# Altium schematic sheet Arduino_Nano_snippit.SchDoc
size B; Organization: CWRUbotix; Address1: 10900 Euclid Avenue; Address2: Cleveland, OH 44106; Address3: USA
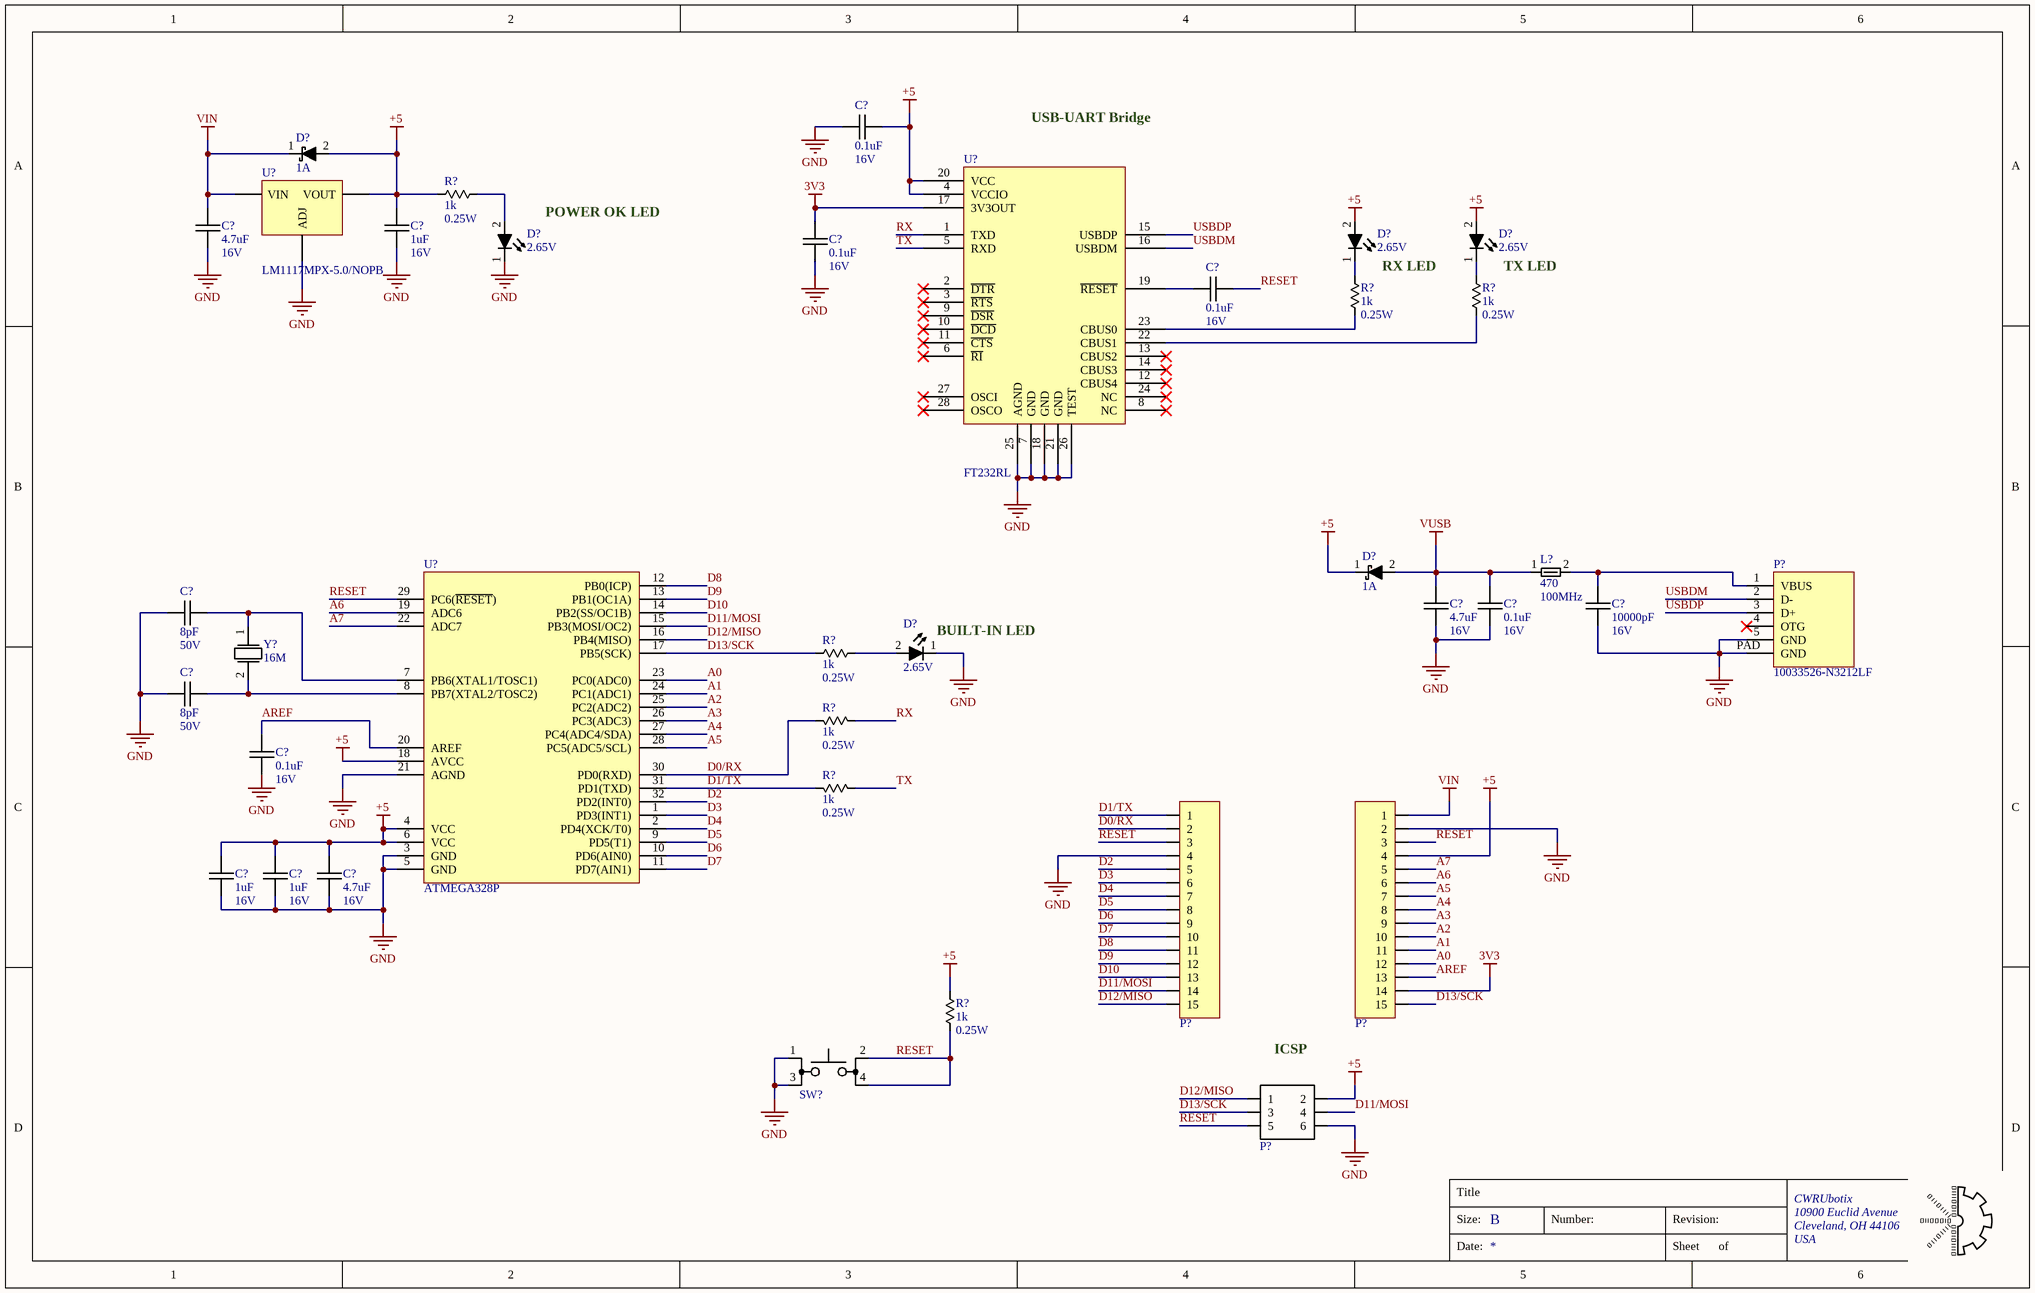
[diagram p0: Arduino_Nano_snippit.SchDoc]

## Parts
(Parts that share a designator on the sheet are numbered #1, #2 ... from top to bottom, then left to right.)
C?#1  Capacitance: 0.1uF  Voltage Rating: 16V  [chip_0603]  (hidden comment: cap_single_np)
C?#2  Capacitance: 4.7uF  Voltage Rating: 16V  [chip_0805]  (hidden comment: cap_single_np)
C?#3  Capacitance: 1uF  Voltage Rating: 16V  [chip_0805]  (hidden comment: cap_single_np)
C?#4  Capacitance: 0.1uF  Voltage Rating: 16V  [chip_0603]  (hidden comment: cap_single_np)
C?#5  Capacitance: 0.1uF  Voltage Rating: 16V  [chip_0603]  (hidden comment: cap_single_np)
C?#6  Capacitance: 0.1uF  Voltage Rating: 16V  [chip_0603]  (hidden comment: cap_single_np)
C?#7  Capacitance: 8pF  Voltage Rating: 50V  [chip_0603]  (hidden comment: cap_single_np)
C?#8  Capacitance: 4.7uF  Voltage Rating: 16V  [chip_0805]  (hidden comment: cap_single_np)
C?#9  Capacitance: 10000pF  Voltage Rating: 16V  [chip_0603]  (hidden comment: cap_single_np)
C?#10  Capacitance: 8pF  Voltage Rating: 50V  [chip_0603]  (hidden comment: cap_single_np)
C?#11  Capacitance: 0.1uF  Voltage Rating: 16V  [chip_0603]  (hidden comment: cap_single_np)
C?#12  Capacitance: 1uF  Voltage Rating: 16V  [chip_0805]  (hidden comment: cap_single_np)
C?#13  Capacitance: 1uF  Voltage Rating: 16V  [chip_0805]  (hidden comment: cap_single_np)
C?#14  Capacitance: 4.7uF  Voltage Rating: 16V  [chip_0805]  (hidden comment: cap_single_np)
D?#1  Current Rating: 1A  [sod123_0]  (hidden comment: diode_2)
D?#2  Forward Voltage: 2.65V  [chip_0603]  (hidden comment: diode_4)
D?#3  Forward Voltage: 2.65V  [chip_0603]  (hidden comment: diode_4)
D?#4  Forward Voltage: 2.65V  [chip_0603]  (hidden comment: diode_4)
D?#5  Current Rating: 1A  [sod123_0]  (hidden comment: diode_2)
D?#6  Forward Voltage: 2.65V  [chip_0603]  (hidden comment: diode_4)
L?  Impedance: 470  Test Freq: 100MHz  [chip_0603]  (hidden comment: bead_0)
P?#1  Manufacturer PN: 10033526-N3212LF  [I10033526]  (hidden comment: usb_micro_b)
P?#2  conn-15x1_0  [HDDR_15x1_0]  (value not drawn)
P?#3  conn-15x1_0  [HDDR_15x1_0]  (value not drawn)
P?#4  conn-3x2_0  [hddr_3x2_0]  (value not drawn)
R?#1  Resistance: 1k  Power Rating: 0.25W  [chip_0603]  (hidden comment: res_single)
R?#2  Resistance: 1k  Power Rating: 0.25W  [chip_0603]  (hidden comment: res_single)
R?#3  Resistance: 1k  Power Rating: 0.25W  [chip_0603]  (hidden comment: res_single)
R?#4  Resistance: 1k  Power Rating: 0.25W  [chip_0603]  (hidden comment: res_single)
R?#5  Resistance: 1k  Power Rating: 0.25W  [chip_0603]  (hidden comment: res_single)
R?#6  Resistance: 1k  Power Rating: 0.25W  [chip_0603]  (hidden comment: res_single)
R?#7  Resistance: 1k  Power Rating: 0.25W  [chip_0603]  (hidden comment: res_single)
SW?  SW_1P1T_0  [KMR6]  (value not drawn)
U?#1  Manufacturer PN: LM1117MPX-5.0/NOPB  [sot-223-4]  (hidden comment: LM1117)
U?#2  FT232RL  [tssop-28_1]
U?#3  ATMEGA328P  [LQFP32_0]
Y?  Frequency: 16M  [smd2-0]  (hidden comment: osc_xtal_2p_0)

## Nets
3V3: C?#4.1 P?#3.14 U?#2.17(3V3OUT)
+5: C?#1.1 C?#3.1 C?#12.1 C?#13.1 C?#14.1 D?#1.2 D?#3.2 D?#4.2 D?#5.1 P?#3.4 P?#4.2 R?#1.1 R?#7.1 U?#1.2(VOUT) U?#2.4(VCCIO) U?#2.20(VCC) U?#3.4(VCC) U?#3.6(VCC) U?#3.18(AVCC)
GND: C?#1.2 C?#2.2 C?#3.2 C?#4.2 C?#6.1 C?#7.1 C?#8.2 C?#9.2 C?#10.1 C?#11.2 C?#12.2 C?#13.2 C?#14.2 D?#2.1 D?#6.1 P?#1.5(GND) P?#1.PAD(GND) P?#2.4 P?#3.2 P?#4.6 SW?.1 SW?.3 U?#1.1(ADJ) U?#2.7(GND) U?#2.18(GND) U?#2.21(GND) U?#2.25(AGND) U?#2.26(TEST) U?#3.3(GND) U?#3.5(GND) U?#3.21(AGND)
VIN: C?#2.1 D?#1.1 P?#3.1 U?#1.3(VIN)
VUSB: C?#6.2 C?#8.1 D?#5.2 L?.1
A0: P?#3.12 U?#3.23(PC0(ADC0))
A1: P?#3.11 U?#3.24(PC1(ADC1))
A2: P?#3.10 U?#3.25(PC2(ADC2))
A3: P?#3.9 U?#3.26(PC3(ADC3))
A4: P?#3.8 U?#3.27(PC4(ADC4/SDA))
A5: P?#3.7 U?#3.28(PC5(ADC5/SCL))
A6: P?#3.6 U?#3.19(ADC6)
A7: P?#3.5 U?#3.22(ADC7)
AREF: C?#11.1 P?#3.13 U?#3.20(AREF)
D0/RX: P?#2.2 R?#5.2 U?#3.30(PD0(RXD))
D1/TX: P?#2.1 R?#6.2 U?#3.31(PD1(TXD))
D2: P?#2.5 U?#3.32(PD2(INT0))
D3: P?#2.6 U?#3.1(PD3(INT1))
D4: P?#2.7 U?#3.2(PD4(XCK/T0))
D5: P?#2.8 U?#3.9(PD5(T1))
D6: P?#2.9 U?#3.10(PD6(AIN0))
D7: P?#2.10 U?#3.11(PD7(AIN1))
D8: P?#2.11 U?#3.12(PB0(ICP))
D9: P?#2.12 U?#3.13(PB1(OC1A))
D10: P?#2.13 U?#3.14(PB2(SS/OC1B))
D11/MOSI: P?#2.14 P?#4.4 U?#3.15(PB3(MOSI/OC2))
D12/MISO: P?#2.15 P?#4.1 U?#3.16(PB4(MISO))
D13/SCK: P?#3.15 P?#4.3 R?#4.1 U?#3.17(PB5(SCK))
RESET: C?#5.2 P?#2.3 P?#3.3 P?#4.5 R?#7.2 SW?.2 SW?.4 U?#3.29(PC6(~{RESET}))
RX: R?#5.1 U?#2.1(TXD)
TX: R?#6.1 U?#2.5(RXD)
USBDM: P?#1.2(D-) U?#2.16(USBDM)
USBDP: P?#1.3(D+) U?#2.15(USBDP)
NetC?#5_1: C?#5.1 U?#2.19(~{RESET})
NetC?#7_2: C?#7.2 U?#3.7(PB6(XTAL1/TOSC1)) Y?.1
NetC?#9_1: C?#9.1 L?.2 P?#1.1(VBUS)
NetC?#10_2: C?#10.2 U?#3.8(PB7(XTAL2/TOSC2)) Y?.2
NetD?#2_2: D?#2.2 R?#1.2
NetD?#3_1: D?#3.1 R?#2.1
NetD?#4_1: D?#4.1 R?#3.1
NetD?#6_2: D?#6.2 R?#4.2
NetR?#2_2: R?#2.2 U?#2.23(CBUS0)
NetR?#3_2: R?#3.2 U?#2.22(CBUS1)

Not connected (* = marked no-connect by the designer): P?#1 4(OTG)*; U?#2 2(~{DTR})* 3(~{RTS})* 6(~{RI})* 8(NC)* 9(~{DSR})* 10(~{DCD})* 11(~{CTS})* 12(CBUS4)* 13(CBUS2)* 14(CBUS3)* 24(NC)* 27(OSCI)* 28(OSCO)*

## Notes on the sheet
- USB-UART Bridge
- (near D?#2) POWER OK LED
- RX LED
- TX LED
- (near D?#6) BUILT-IN LED
- (near P?#4) ICSP
- Title
- Size:
- B
- Number:
- Revision:
- Date:
- Sheet
- of

## Library data of the parts
C?#1 C?#4-C?#6 C?#11 = CAP-00542: CAP, 0.1uF, ±10%, 16V, X7R, 0603; Manufacturer: Murata; Tolerance: ±10%; Part Number: CAP-00542; Type: X7R
C?#2 C?#8 C?#14 = CAP-00127: CAP, 4.7uF, 10%, 16V, X7R, 0805; Manufacturer: Murata; Manufacturer PN: GRM21BR71C475KA73L; Tolerance: 10%; Part Number: CAP-00127; Type: X7R
C?#3 C?#12 C?#13 = CAP-00107: CAP, 1uF, 10%, 16V, X7R, 0805; Manufacturer: Murata; Manufacturer PN: GRM21BR71C105KA01L; Tolerance: 10%; Part Number: CAP-00107; Type: X7R
C?#7 C?#10 = CAP-00402: CAP, 8pF, ±0.1pF, 50V, C0G, 0603; Manufacturer: Murata; Manufacturer PN: GRM1885C1H8R0BA01D; Tolerance: ±0.1pF; Part Number: CAP-00402; Type: C0G
C?#9 = CAP-00543: CAP, 10000pF, ±10%, 16V, X7R, 0603; Tolerance: ±10%; Part Number: CAP-00543; Type: X7R
D?#1 D?#5 = DIO-00001: Dio Shtky, 1A, 0.55V, 40V, SOD-123; Manufacturer: ON Semi; Manufacturer PN: MBR140SFT1G; Forward Voltage: 550mV; Type: Schottky; Reverse Breakdown Voltage: 40V; Part Number: DIO-00001
D?#2-D?#4 D?#6 = DIO-00049: LED, Blue, 0603, Low current, HELI2 Series; Manufacturer: Kingbright; Manufacturer PN: APT1608LVBC/D; Reverse Breakdown Voltage: 5V; Current Rating: 30mA; Power Rating: 120mW; Type: LED; Part Number: DIO-00049; Cost: 0.58
L? = MAG-00000: Fe Bead, 470 @ 100MHz, 0603; Manufacturer: Samsung; Manufacturer PN: CIC10P471NC; Part Number: MAG-00000; Cost: 0.1
P?#1 = CONN-00041: USB Mini B, Surface Mount; Manufacturer: Amphenol; Positions per level: 5; Levels: 1; Part Number: CONN-00041; Type: USB Mini B; Cost: 0.77
P?#2 P?#3 = CONN-00040: Header, 15x1, 0x1"; Positions per level: 15; Levels: 1; Part Number: CONN-00040; Type: Header
P?#4 = CONN-00002: Header, 3x2, 0.1"; Manufacturer: Wurth Electronics Inc.; Manufacturer PN: 61300621121; Positions per level: 3; Levels: 2; Part Number: CONN-00002; Type: Header; Current: 3; Cost: 0.54
R?#1-R?#7 = RES-00360: RES SMD 1K OHM 1% 1/4W 0603; Manufacturer: Panasonic; Manufacturer PN: ERJ-PA3F1001V; Tolerance: 1%; Part Number: RES-00360
SW? = MISC-00024: Switch, SPST, Tactile, 32V 50mA; Manufacturer PN: KMR621NG LFS; Manufacturer: C&K; Part Number: MISC-00024; Cost: 0.33
U?#1 = PWREG-00028: REG, Linear, Fixed 5V, 800mA, SOT-223, LM1117-5.0; Manufacturer: TI; Voltage Range In: 6.2 - 20V; Part Number: PWREG-00028; Voltage Range Out: 5V; Max Current: 800mA; Reg Type: Linear; Fixed/Adj: Fixed; Cost: 1.14
U?#2 = IFACE-00005: USB to UART transceiver, FT232RL; Manufacturer: FTDI; Part Number: IFACE-00005; Cost: 4.5
U?#3 = UCTRL-00003: Atmel AVR 328P, LQFP32; Manufacturer PN: ATMEGA328P; Part Number: UCTRL-00003; Manufacturer: Atmel
Y? = OSC-00000: XTAL, 16MHz, 8pF, 50, 20ppm; Manufacturer: NDK; Manufacturer PN: NX5032GA-16MHZ-STD-CSK-4; ESR: 50; Stability: 30ppm; Load Capacitance: 8pF; Tolerance: 20ppm; Part Number: OSC-00000